# EAGLE design Final Project Designs_v1 (EAGLE 7.6.0)

## Sheet 1 of 2
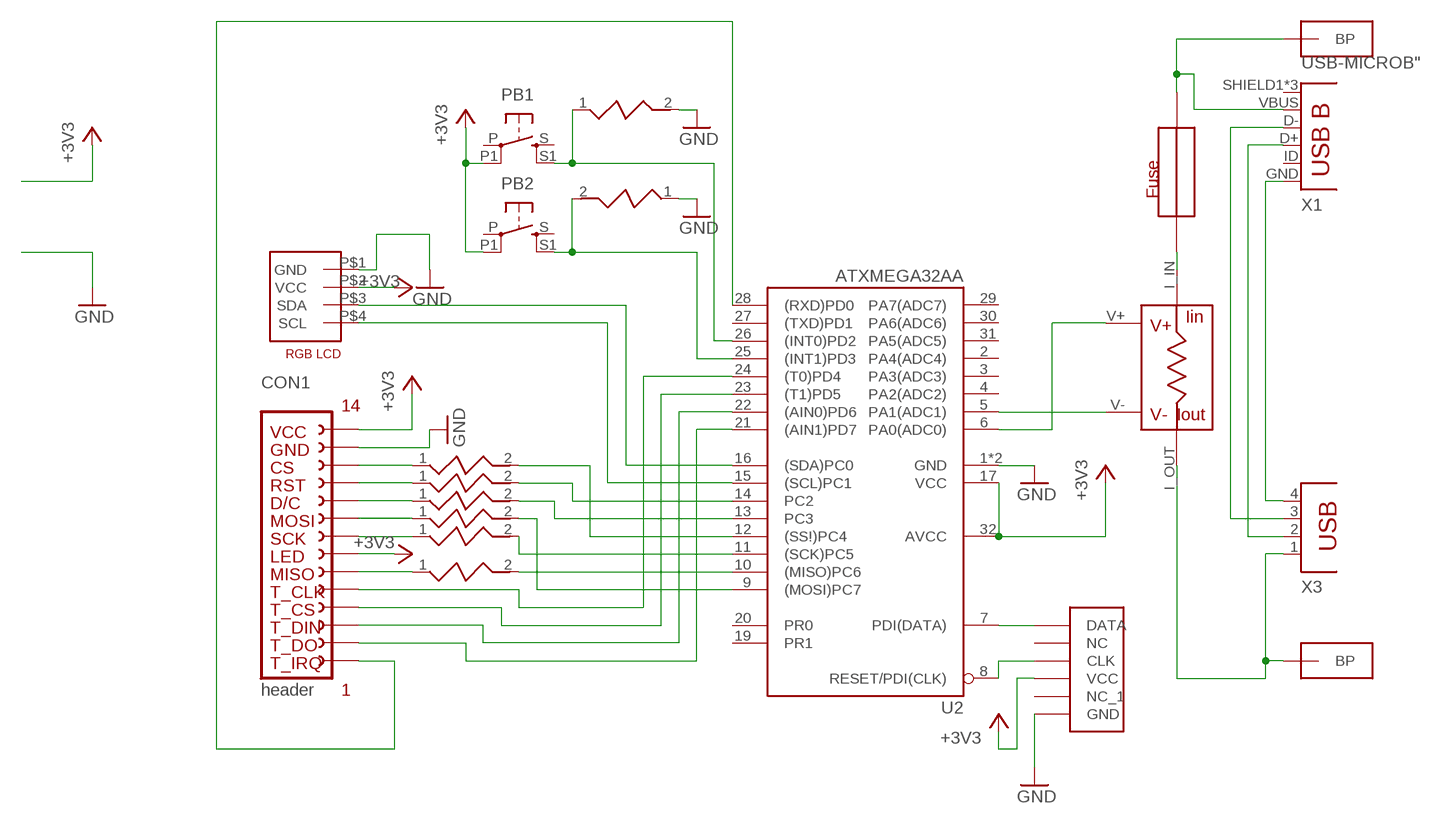
[diagram p0: schematic, sheet 1]

### Parts
CON1  header  14_PIN_FEMALE_HEADER  [FE15]
CON2  4PIN_GROVE_CONNECTORUNIVERSAL_4_PIN_CONNECTOR  [RGB_LCD]
F1  FUSE_SMT  [FUSE_SMT]
PB1  10-XX-4.5SMD  [BT4.5X4.5]
PB2  10-XX-4.5SMD  [BT4.5X4.5]
R1  RESISTOR_4PIN  [RESISTOR_4PIN]
R2  RESISTOR  [RESISTOR]
R3  RESISTOR  [RESISTOR]
R4  RESISTOR  [RESISTOR]
R5  RESISTOR  [RESISTOR]
R6  RESISTOR  [RESISTOR]
R7  RESISTOR  [RESISTOR]
R8  RESISTOR  [RESISTOR]
R9  RESISTOR  [RESISTOR]
U2  ATXMEGA32AA  [TQFP32-08]
X1  USB-MICROB"  [USB-B-MICRO-SMD_V03]
X3  PN87520  [PN87520]
X4  JTAG  [JTAG]
X5  BANANA_PLUG  [BANANA_PLUG]
X6  BANANA_PLUG  [BANANA_PLUG]

### Nets
+3V3: CON1.P$7(LED) CON1.P$14(VCC) CON2.P$2(VCC) PB1.P1 PB2.P1 U2.17(VCC) U2.32(AVCC) X4.VCC
B$2: R1.I_OUT X3.1 X5.P$1(BP) X5.P$2(BP)
GND: CON1.P$13(GND) CON2.P$1(GND) R8.2 R9.1 U2.1(GND) U2.18(GND) X4.GND ; also sheet 2
N$1: R5.2 U2.9((MOSI)PC7)
N$2: R6.2 U2.11((SCK)PC5)
N$3: CON1.P$9(MOSI) R5.1
N$4: CON2.P$4(SCL) U2.15((SCL)PC1)
N$5: CON2.P$3(SDA) U2.16((SDA)PC0)
N$6: X1.GND X3.4
N$7: X1.D+ X3.2
N$8: X1.D- X3.3
N$9: PB2.S1 R9.2 U2.25((INT1)PD3)
N$10: PB1.S1 R8.1 U2.26((INT0)PD2)
N$11: R2.2 U2.12((SS!)PC4)
N$12: U2.7(PDI(DATA)) X4.DATA
N$13: U2.8(RESET/PDI(CLK)) X4.CLK
N$14: R1.V+ U2.6(PA0(ADC0))
N$15: R1.V- U2.5(PA1(ADC1))
N$16: F1.P$2 R1.I_IN
N$17: CON1.P$10(D/C) R4.1
N$18: CON1.P$11(RESET) R3.1
N$19: CON1.P$6(MISO) R7.1
N$20: R7.2 U2.10((MISO)PC6)
N$21: CON1.P$8(SCK) R6.1
N$22: CON1.P$12(CS) R2.1
N$23: F1.P$1 X1.VBUS X6.P$1(BP) X6.P$2(BP)
N$24: CON1.P$5(T_CLK) U2.24((T0)PD4)
N$25: CON1.P$4(T_CS) U2.23((T1)PD5)
N$26: CON1.P$3(T_DIN) U2.22((AIN0)PD6)
N$27: CON1.P$2(T_DO) U2.21((AIN1)PD7)
N$28: R3.2 U2.14(PC2)
N$29: R4.2 U2.13(PC3)
N$30: CON1.P$1(T_IRQ) U2.28((RXD)PD0)
Unconnected: PB1.P PB1.S PB2.P PB2.S U2.2(PA4(ADC4)) U2.3(PA3(ADC3)) U2.4(PA2(ADC2)) U2.19(PR1) U2.20(PR0) U2.27((TXD)PD1) U2.29(PA7(ADC7)) U2.30(PA6(ADC6)) U2.31(PA5(ADC5)) X1.ID(USBID) X1.SHIELD1(SHIELD) X1.SHIELD2(SHIELD) X1.SHIELD3(SHIELD) X4.NC X4.NC1(NC_1)

## Sheet 2 of 2
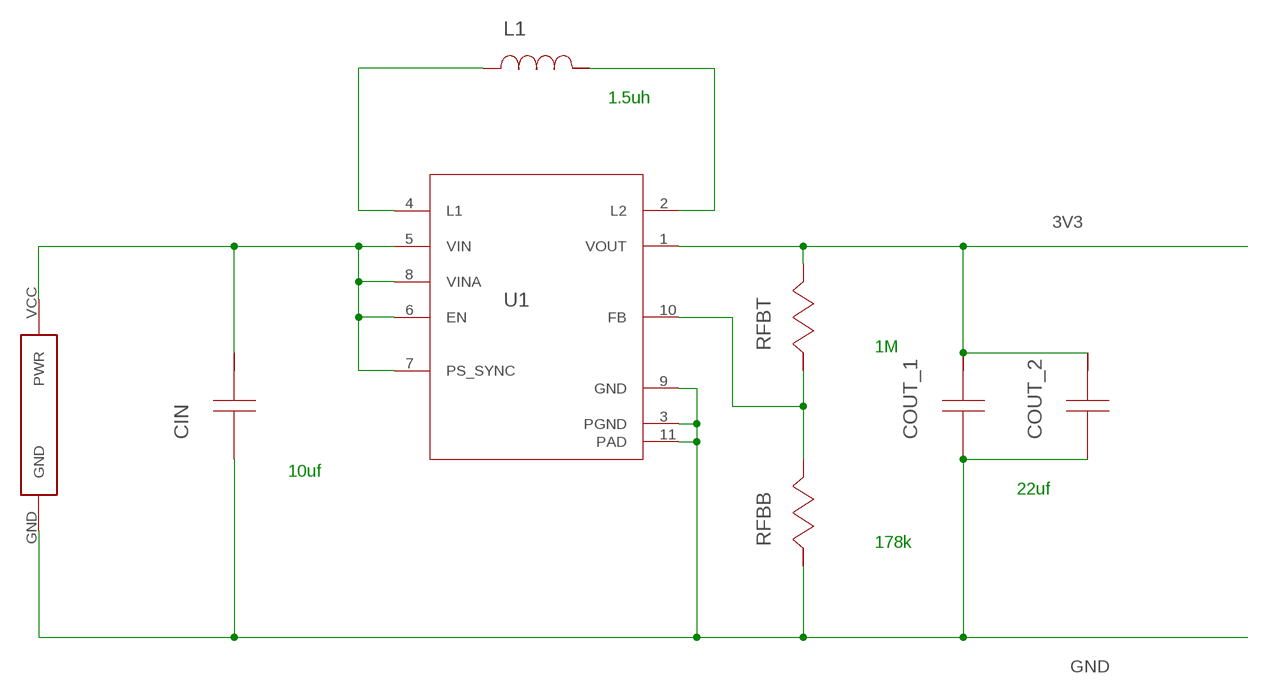
[diagram p1: schematic, sheet 2]

### Parts
CIN  LMK212BJ106KG-T  [0805]
COUT_1  LMK212BJ226MG-T  [0805]
COUT_2  LMK212BJ226MG-T  [0805]
L1  LQM21PN1R5MC0D  [0805]
RFBB  CRCW0402178KFKED  [0402]
RFBT  CRCW04021M00FKED  [0402]
U1  TPS63000DRCR  [DRC0010J]
U$1  BATTERY  [BATTERY]

### Nets
2: L1.1 U1.4(L1)
3V3: COUT_1.1 COUT_2.1 RFBT.1 U1.1(VOUT)
4: L1.2 U1.2(L2)
GND: CIN.2 COUT_1.2 COUT_2.2 RFBB.2 U1.3(PGND) U1.9(GND) U1.11(PAD) U$1.GND ; also sheet 1
N$31: RFBB.1 RFBT.2 U1.10(FB)
VIN: CIN.1 U1.5(VIN) U1.6(EN) U1.7(PS_SYNC) U1.8(VINA) U$1.VCC(PWR)

### Notes on the sheet
- 1.5uh
- 1M
- 10uf
- 22uf
- 178k

## Library data of the parts
CIN = sps:LMK212BJ106KG-T
CON1 = Tft_lcd_header:14_PIN_FEMALE_HEADER: FEMALE HEADER; OC_FARNELL: unknown; OC_NEWARK: unknown
CON2 = Tft_lcd_header:4PIN_GROVE_CONNECTOR
COUT_1 COUT_2 = sps:LMK212BJ226MG-T
F1 = fuse_smt:FUSE_SMT
L1 = sps:LQM21PN1R5MC0D
PB1 PB2 = Tft_lcd_header:10-XX: OMRON SWITCH
R1 = Tft_lcd_header:RESISTOR_4PIN
R2-R9 = Tft_lcd_header:RESISTOR
RFBB = sps:CRCW0402178KFKED
RFBT = sps:CRCW04021M00FKED
U1 = sps:TPS63000DRCR
U2 = Tft_lcd_header:ATXMEGA32A: MICROCONTROLLER 2 Kbytes FLASH 128 bytes SRAM 128 bytes EEPROM UART 6-channel 10-bit ADC; OC_FARNELL: unknown; OC_NEWARK: unknown
U$1 = Tft_lcd_header:BATTERY
X1 = SparkFun-Connectors:USB-MICROB; PROD_ID: CONN-11752
X3 = con-berg:PN87520: BERG USB connector; OC_FARNELL: unknown; OC_NEWARK: unknown
X4 = Tft_lcd_header:JTAG
X5 X6 = Tft_lcd_header:BANANA_PLUG

## Board
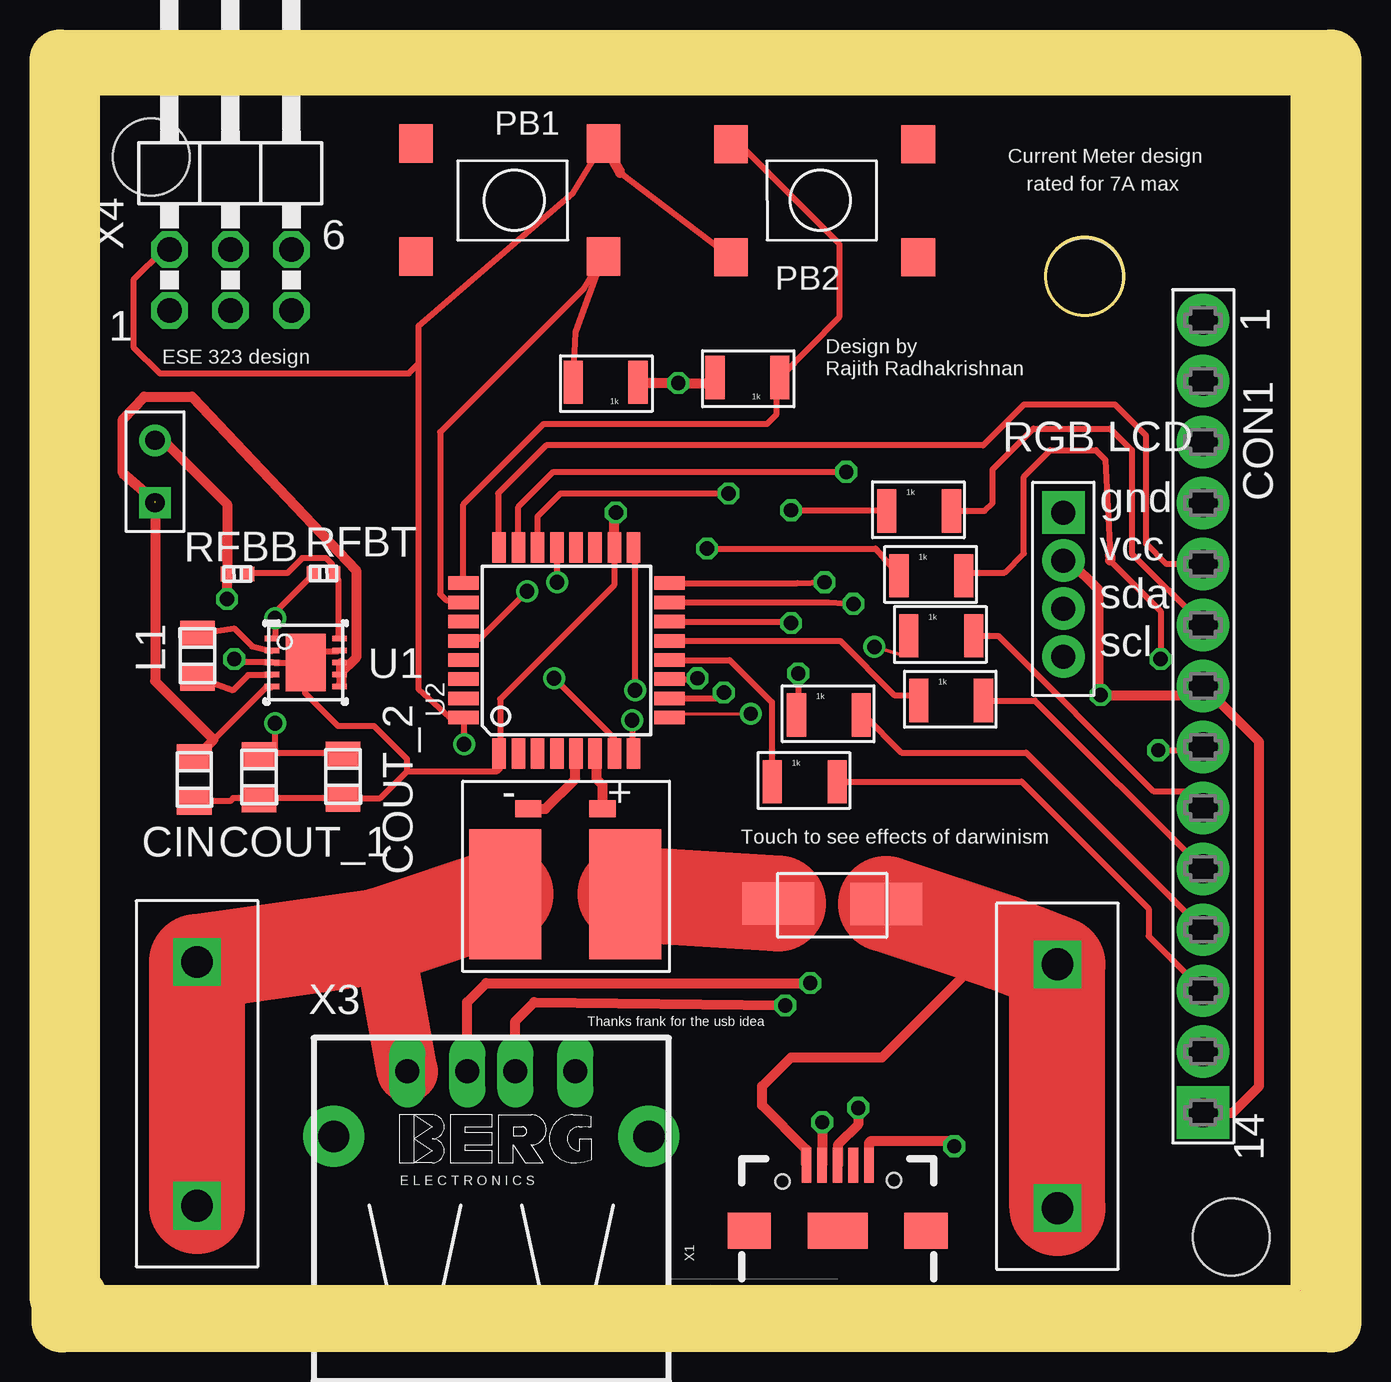
[diagram p2: board, top side]
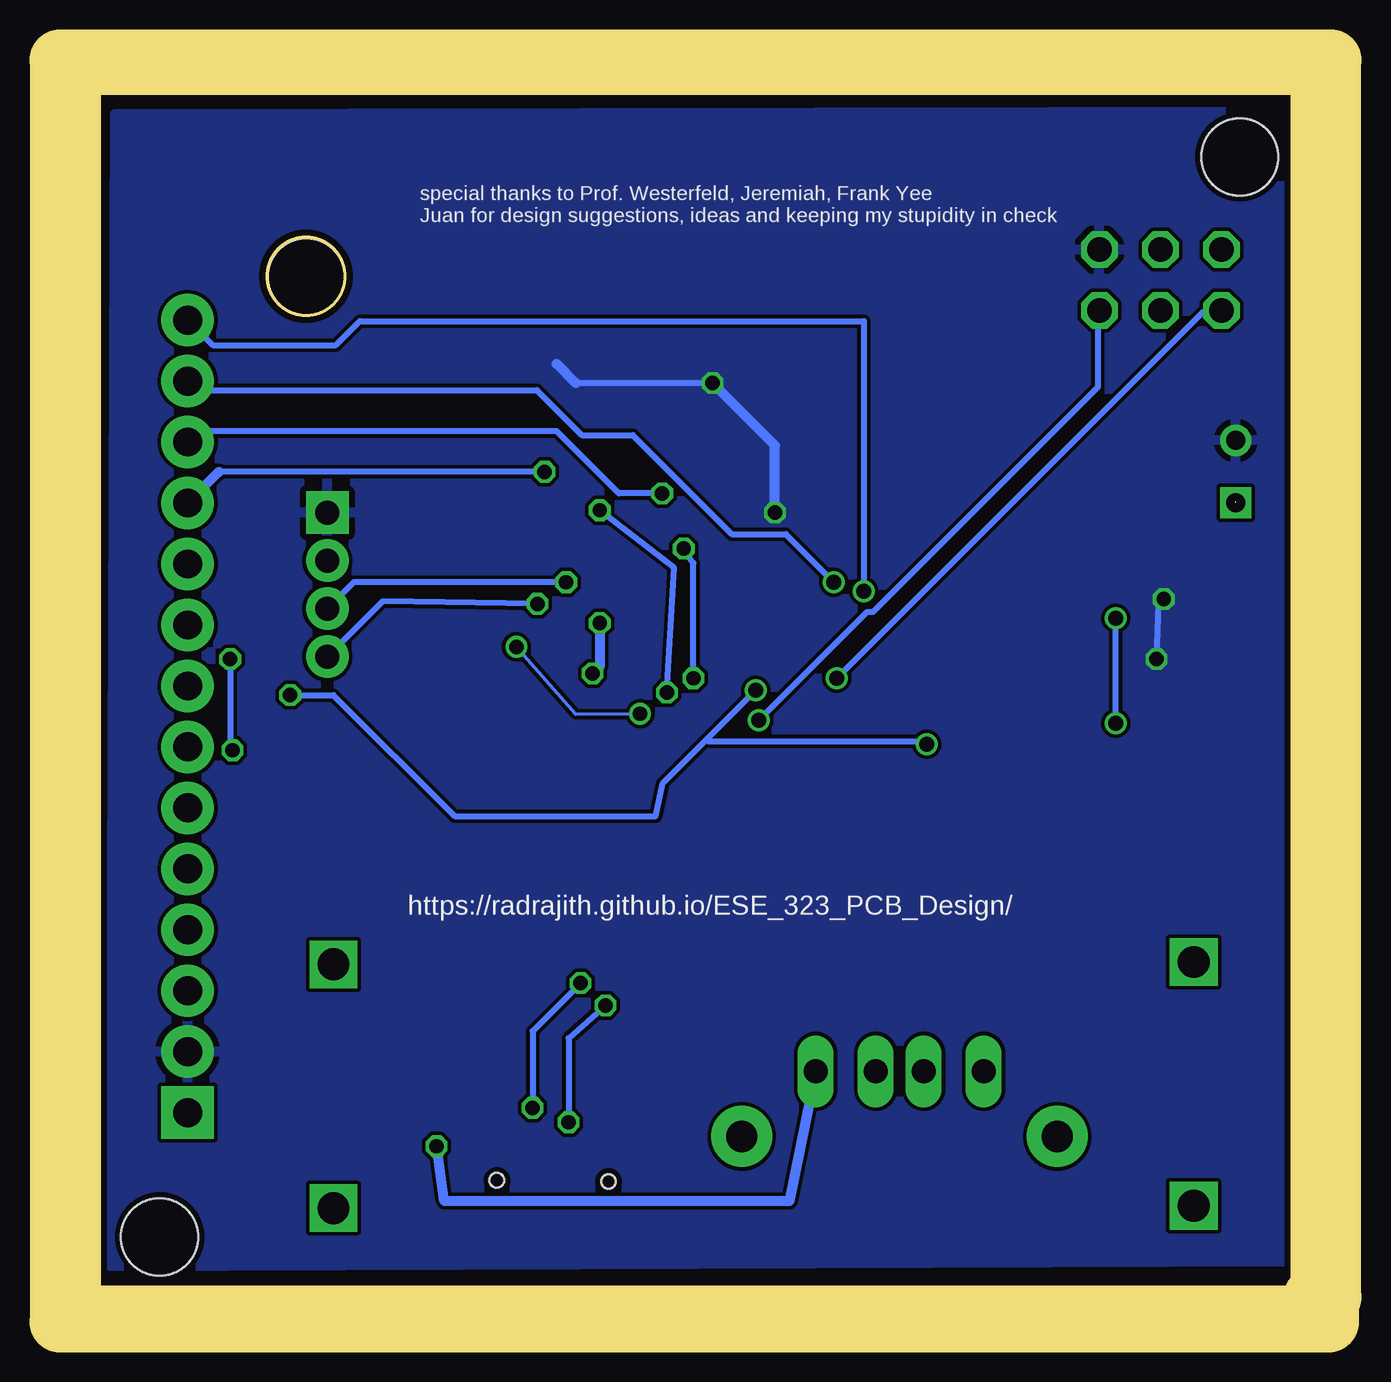
[diagram p3: board, bottom side, seen from below]

Size 52.95 x 52.58 mm. Coordinates in mm from the lower left corner, seen from the top.
Outline: 0.69,1.04 0,1.04 0,52.58 52.95,52.58 52.95,0 0.09,0 0.09,3.38
Outline: 1.46,51.32 51.46,51.32 51.46,1.32 1.46,1.32 1.46,51.32
Copper layers (1*16): Top 0.035mm / dielectric 1.5mm / Bottom 0.035mm
Design rules "SeeedStudio_2layer_DRU_no_angle_20140221": minimum track width 6mil, minimum drill 12mil, track to track 6mil, track to pad 6mil, pad to pad 6mil, via to via 6mil, smd to smd 0mil, copper to edge 10mil, drill to drill 10mil, minimum pad ring 10mil, minimum via ring 6mil, stop-mask expansion 2mil, vias tented up to drill 100mil, thermal gap 10mil
Holes 3.2 mm at 3.8,48.54 48.8,3.54

### Footprints (pad centres in the part's own frame; a part is rotated, then mirrored left to right if it is on the bottom)
0805 = smd 1.118 x 1.448: 1 -0.902,0; 2 0.902,0
FE15 = drill 1.2 pad 2.184: P$1 0,0; P$2 0,2.54; P$3 0,5.08; P$4 0,7.62; P$5 0,10.16; P$6 0,12.7; P$7 0,15.24; P$8 0,17.78; P$9 0,20.32; P$10 0,22.86; P$11 0,25.4; P$12 0,27.94; P$13 0,30.48 | drill 1.2 pad 2.184 square: P$14 0,33.02 | hole 3.2: 4.94,-1.81
RGB_LCD = drill 1 pad 1.778 square: P$1 0,0 | drill 1 pad 1.778: P$2 0,-2; P$3 0,-4; P$4 0,-6
FUSE_SMT = smd 3 x 1.78: P$1 1.5,0.89; P$2 -3,0.91
BT4.5X4.5 = smd 1.4 x 1.6: P -5.25,2.15; P1 2.55,2.15; S -5.25,-2.56; S1 2.55,-2.56
RESISTOR_4PIN = smd 3 x 5.4: I_IN 2.08,-2.68; I_OUT -2.92,-2.68 | smd 1.1 x 0.7: V+ 1.13,0.88; V- -1.97,0.88
RESISTOR = smd 0.8 x 1.8: 1 -0.2,0.8; 2 -2.9,0.8
0402 = smd 0.559 x 0.61: 1 -0.419,0; 2 0.419,0
DRC0010J = smd 0.6 x 0.24: 1 -1.4,1; 2 -1.4,0.5; 3 -1.4,0; 4 -1.4,-0.5; 5 -1.4,-1; 6 1.4,-1; 7 1.4,-0.5; 8 1.4,0; 9 1.4,0.5; 10 1.4,1 | smd 1.65 x 2.4: 11 0,0
TQFP32-08 = smd 1.27 x 0.559: 1 -4.293,2.8; 2 -4.293,2; 3 -4.293,1.2; 4 -4.293,0.4; 5 -4.293,-0.4; 6 -4.293,-1.2; 7 -4.293,-2; 8 -4.293,-2.8; 17 4.293,-2.8; 18 4.293,-2; 19 4.293,-1.2; 20 4.293,-0.4; 21 4.293,0.4; 22 4.293,1.2; 23 4.293,2; 24 4.293,2.8 | smd 0.559 x 1.27: 9 -2.8,-4.293; 10 -2,-4.293; 11 -1.2,-4.293; 12 -0.4,-4.293; 13 0.4,-4.293; 14 1.2,-4.293; 15 2,-4.293; 16 2.8,-4.293; 25 2.8,4.293; 26 2,4.293; 27 1.2,4.293; 28 0.4,4.293; 29 -0.4,4.293; 30 -1.2,4.293; 31 -2,4.293; 32 -2.8,4.293
BATTERY = drill 0.8: GND 0,2.6 | drill 0.8 square: VCC 0,0
USB-B-MICRO-SMD_V03 = smd 1.45 x 0.4: D+ 2.725,0; D- 2.725,0.65; GND 2.725,-1.3; ID 2.725,-0.65; VBUS 2.725,1.3 | smd 1.5 x 1.8: SHIELD1 0,3.685; SHIELD2 0,-3.685 | smd 1.5 x 2.5: SHIELD3 0,0 | hole 0.6: 2.05,2.3; 2.1,-2.35
PN87520 = drill 1 long: 1 -3.5,2.71; 2 -1,2.71; 3 1,2.71; 4 3.5,2.71 | drill 1.3 pad 2.54: P$1 -6.57,0; P$2 6.57,0
JTAG = drill 1.016 octagon: CLK 0,-2.54; DATA -5.08,-2.54; GND 0,0; NC -2.54,-2.54; NC1 -2.54,0; VCC -5.08,0
BANANA_PLUG = drill 1.321 square: P$1 -5.08,0; P$2 5.08,0

### Placement (x,y rotation side)
CIN  5.59,22.6 270 top
CON1  47.63,41.74 180 top
CON2  41.81,33.72 0 top
COUT_1  8.29,22.7 270 top
COUT_2  11.79,22.72 270 top
F1  32.92,16.52 0 top
L1  5.73,27.76 90 top
PB1  20.09,46.95 0 top
PB2  30.51,46.51 180 top
R1  21.48,20.5 0 top
R2  32.58,21.71 0 top
R3  33.59,24.49 0 top
R4  38.68,25.09 0 top
R5  38.27,27.79 0 top
R6  37.86,30.29 0 top
R7  37.35,32.99 0 top
R8  21.18,39.95 180 top
R9  27.09,40.15 180 top
RFBB  7.39,31.16 180 top
RFBT  10.98,31.18 0 top
U1  10.24,27.48 0 top
U2  21.1,27.98 90 top
U$1  3.96,34.13 0 top
X1  32.4,3.8 90 top
X3  17.97,7.73 0 top
X4  9.64,44.68 0 top
X5  5.71,9.92 90 top
X6  41.56,9.82 90 top

### Tracks (layer width: path | path; a pad name or v marks a point on that pad's centre or on a via)
2
  Top 0.254: U1.4 8.84,26.95 7.83,26.95 7.21,26.32 5.83,26.82 L1.1
3V3  (via drill 0.61)
  Top 0.254: U1.1 8.96,28.57 v8.96,29.32 8.96,29.57 10.46,31.07 RFBT.1 | COUT_2.1 11.71,23.7 8.34,23.7 COUT_1.1 8.96,23.82 v8.96,24.95
  Bottom 0.254: v8.96,24.95 v8.96,29.32
4
  Top 0.254: U1.2 8.84,27.95 8.01,28.14 7.26,28.89 5.83,28.7 L1.2
+3V3  (via drill 0.6, 0.61)
  Top 0.254: PB1.P1 21.38,47.04 14.94,41.49 14.94,39.92 | 14.94,39.92 14.94,26.37 16.21,25.2 16.71,25.2 U2.32 16.84,25.07 v16.84,24.07 | v23.96,26.32 23.96,32.2 U2.17 | 23.34,47.88 PB2.P1 | X4.VCC 4.32,44.68 3.06,43.42 3.06,40.62 4.16,39.52 14.54,39.52 14.94,39.92
  Top 0.406: PB1.P1 23.34,47.88 | CON1.P$14 48.86,8.72 49.96,9.82 49.96,24.17 CON1.P$7 47.03,26.5 46.65,26.12 v43.36,26.12 43.26,26.22 43.26,30.52 42.06,31.72 CON2.P$2
  Bottom 0.254: 26.02,24.26 27.84,22.45 28.14,21.07 36.51,21.07 41.56,26.12 v43.36,26.12 | 26.02,24.26 v23.96,26.32 | v16.84,24.07 16.96,24.2 25.96,24.2 26.02,24.26
  Bottom 0.406: CON1.P$7 47.03,26.5
B$2
  Top 0.254: 6.33,3.94 X5.P$1
  Top 2.54: X3.1 13.44,16.11
  Top 4: X5.P$1 X5.P$2 13.38,16.1 | 13.38,16.1 13.44,16.11 | R1.I_OUT 13.38,16.1
GND  (via drill 0.6)
  Top 0.254: U1.11 10.34,27.45 10.21,27.32 10.09,27.45 8.96,27.45 U1.3 7.2,27.48 v7.26,27.62 | U1.9 11.59,27.95 10.21,27.95 10.21,27.57 U1.11 | CIN.2 5.71,21.7 7.08,21.7 7.21,21.82 8.21,21.82 COUT_1.2 8.34,21.82 11.71,21.82 COUT_2.2 11.84,21.82 13.34,21.82 14.46,22.95 | 14.46,22.95 18.21,22.95 18.34,23.07 18.34,23.57 U2.1 18.34,23.7 18.34,25.95 23.09,30.7 23.09,32.07 U2.18 | 14.46,22.95 14.46,23.45 13.09,24.82 11.59,24.82 10.21,26.2 10.21,27.2 U1.11 | 6.96,31.2 RFBB.2
  Top 0.406: 6.96,31.2 6.96,34.07 4.3,36.73 U$1.GND | v6.96,30.12 RFBB.2 | U2.18 23.1,33.66 v23.16,33.72 | R8.2 24,39.12 v25.76,39.12 27.16,39.12 R9.1
  Bottom 0.254: 41.96,33.7 CON2.P$1 | v7.26,27.62 7.16,29.92 v6.96,30.12 | v25.76,39.12 31.46,39.12
  Bottom 0.406: v23.16,33.72 23.16,36.52 v25.76,39.12 | 31.46,39.12 32.26,39.92
  pour Bottom: 2.06,50.42 50.66,50.32 50.86,2.32 1.86,2.52
N$1  (via drill 0.6)
  Top 0.152: v28.78,25.34 25.46,25.32 U2.9 | v33.93,28.13 34.96,27.82 35.46,28.32 R5.2
  Bottom 0.152: v28.78,25.34 31.46,25.32 v33.93,28.13
N$2  (via drill 0.6)
  Top 0.254: U2.11 26.52,26.78 v26.56,26.82 | v26.96,32.22 33.98,32.22 R6.2
  Bottom 0.254: v26.56,26.82 26.56,31.62 v26.96,32.22
N$3
  Top 0.254: R5.1 39.09,28.59 45.56,22.12 46.93,22.12 CON1.P$9
N$4  (via drill 0.6)
  Top 0.254: U2.15 32.02,29.98 v33.06,29.92
  Bottom 0.254: v33.06,29.92 39.51,30.02 CON2.P$4
N$5  (via drill 0.6)
  Top 0.254: U2.16 30.72,30.78 v31.86,30.82
  Bottom 0.254: v31.86,30.82 40.71,30.82 CON2.P$3
N$6  (via drill 0.6)
  Top 0.406: v37.26,7.32 37.06,7.52 33.76,7.52 33.7,7.46 X1.GND
  Bottom 0.406: X3.4 22.56,5.03 36.93,5.03 v37.26,7.32
N$7  (via drill 0.6)
  Top 0.254: 32.41,6.54 X1.D+
  Top 0.406: X3.2 16.96,13.32 17.76,14.12 v31.26,14.12 | v33.26,8.92 33.26,8.22 32.41,7.38 32.41,6.54
  Bottom 0.254: v31.26,14.12 33.26,12.12 v33.26,8.92
N$8  (via drill 0.6)
  Top 0.406: X3.3 18.97,12.53 19.76,13.32 v30.22,13.19 | 31.76,6.54 X1.D- v31.75,8.31 v31.76,8.32
  Bottom 0.254: v30.22,13.19 31.76,11.82 v31.76,8.32
N$9
  Top 0.254: U2.25 16.81,34.07 20.16,37.42 29.46,37.42 29.86,37.82 29.86,39.27 | PB2.S1 28.42,48.96 32.46,44.92 32.46,41.87 R9.2
  Top 0.406: 29.86,39.27 R9.2
N$10
  Top 0.254: U2.26 16.71,30.07 16.09,30.07 15.84,30.32 15.84,37.07 21.84,43.07 PB1.S1 21.48,41.24 R8.1
N$11
  Top 0.254: U2.12 27.9,27.58 29.66,25.82 29.66,22.68 R2.2
N$12  (via drill 0.61)
  Top 0.254: v20.59,26.82 23.09,24.32 23.09,23.7 U2.7
  Bottom 0.254: v20.59,26.82 5.33,42.07 4.58,42.07 X4.DATA
N$13  (via drill 0.61)
  Top 0.254: v23.84,25.07 23.84,23.7 U2.8
  Bottom 0.254: v23.84,25.07 19.34,29.57 19.09,29.57 9.71,38.95 9.71,42.07 X4.CLK
N$14
  Top 0.406: R1.V+ 22.61,22.37 22.36,22.62 22.36,23.63 U2.6
N$15
  Top 0.406: R1.V- 20.22,21.38 21.46,22.62 21.46,23.65 U2.5
N$16
  Top 4: F1.P$2 R1.I_IN
N$17
  Top 0.254: R4.1 40.62,25.89 CON1.P$10
N$18
  Top 0.254: 33.49,25.29 35.06,23.72 40.25,23.72 CON1.P$11
  Top 0.406: R3.1 33.49,25.29
N$19
  Top 0.254: R7.1 38.53,33.79 38.86,34.12 38.86,35.52 40.56,37.22 43.76,37.22 44.66,36.32 44.66,32.01 CON1.P$6
N$20  (via drill 0.6)
  Top 0.254: U2.10 27.36,25.98 v27.66,26.22 | v30.46,33.82 34.33,33.82
  Top 0.406: 34.33,33.82 R7.2
  Bottom 0.254: v27.66,26.22 27.36,31.42 v30.46,33.82
N$21  (via drill 0.6)
  Top 0.254: 37.66,31.22 39.36,31.22 40.16,32.02 40.16,35.22 41.26,36.32 43.16,36.32 43.56,35.92 43.76,31.93 | 43.76,31.72 45.86,29.62 v45.86,27.62 | v45.76,23.82 47.49,23.82
  Top 0.406: R6.1 37.56,31.12 37.66,31.22 | 43.76,31.93 43.76,31.72 | 47.49,23.82 CON1.P$8
  Bottom 0.254: v45.86,27.62 45.86,23.92
  Bottom 0.406: 45.86,23.92 v45.76,23.82
N$22
  Top 0.254: R2.1 40.07,22.51 45.36,17.22 45.36,16.07 CON1.P$12
N$23
  Top 0.406: 39.25,15.8 38.46,15.02 38.26,15.02 34.26,11.02 30.46,11.02 29.26,9.82 29.26,9.02 31.1,7.18 X1.VBUS
  Top 4: X6.P$1 X6.P$2 39.25,15.8 F1.P$1
N$24
  Top 0.254: CON1.P$5 46.1,31.58 45.26,32.42 45.26,36.92 43.96,38.22 40.16,38.22 38.46,36.52 20.26,36.52 18.26,34.52 18.26,32.31
  Top 0.406: 18.26,32.31 U2.24
N$25  (via drill 0.6)
  Top 0.254: U2.23 19.1,33.96 20.56,35.42 v32.76,35.42
  Bottom 0.254: v32.76,35.42 46.33,35.42
  Bottom 0.406: 46.33,35.42 CON1.P$4
N$26  (via drill 0.6)
  Top 0.254: U2.22 19.9,33.56 20.86,34.52 v27.86,34.52
  Bottom 0.254: v27.86,34.52 29.66,34.52 32.26,37.12 47.17,37.12
  Bottom 0.406: 47.17,37.12 CON1.P$3
N$27  (via drill 0.61)
  Top 0.254: v20.71,30.82 20.71,32.2 U2.21
  Bottom 0.254: v20.71,30.82 22.71,32.82 24.96,32.82 29.09,36.95 31.21,36.95 33.09,38.82 47.21,38.82 47.58,39.2 CON1.P$2
N$28  (via drill 0.6)
  Top 0.254: U2.14 30.4,29.18 v30.46,29.12 | v30.76,27.02 30.76,25.37
  Top 0.406: 30.76,25.37 R3.2
  Bottom 0.406: v30.46,29.12 30.46,27.32 v30.76,27.02
N$29
  Top 0.254: U2.13 32.5,28.38 34.76,26.12 35.7,26.12
  Top 0.406: 35.7,26.12 R4.2
N$30  (via drill 0.61)
  Top 0.254: v19.46,30.45 17.46,28.45 16.84,28.45 U2.28
  Bottom 0.254: v19.46,30.45 19.46,41.7 40.46,41.7 41.46,40.7 46.58,40.7 CON1.P$1
N$31
  Top 0.254: U1.10 11.59,28.57 11.59,30.95 11.46,31.07 RFBT.2 11.34,31.2 11.34,31.57 11.09,31.82 10.09,31.82 9.46,31.2 7.83,31.2 RFBB.1
VIN  (1 unrouted)
  Top 0.254: 6.4,24.26 8.59,26.45 8.84,26.45 U1.5 | 11.71,26.57 U1.6 | 11.71,26.95 U1.7 11.71,27.07 | 11.71,27.45 U1.8
  Top 0.406: CIN.1 5.71,23.57 6.4,24.26 3.96,26.7 U$1.VCC | 11.71,26.95 11.71,26.57 | 11.71,27.07 11.71,27.45 | 3.96,34.2 2.62,35.37 2.62,37.62 3.5,38.55 5.5,38.55 12.34,31.32 12.34,27.68 U1.7

### Text on the board
tNames: Current Meter design | rated for 7A max | ESE 323 design | Design by / Rajith Radhakrishnan | Touch to see effects of darwinism | Thanks frank for the usb idea
bNames: special thanks to Prof. Westerfeld, Jeremiah, Frank Yee / Juan for design suggestions, ideas and keeping my stupidity in check | https://radrajith.github.io/ESE_323_PCB_Design/